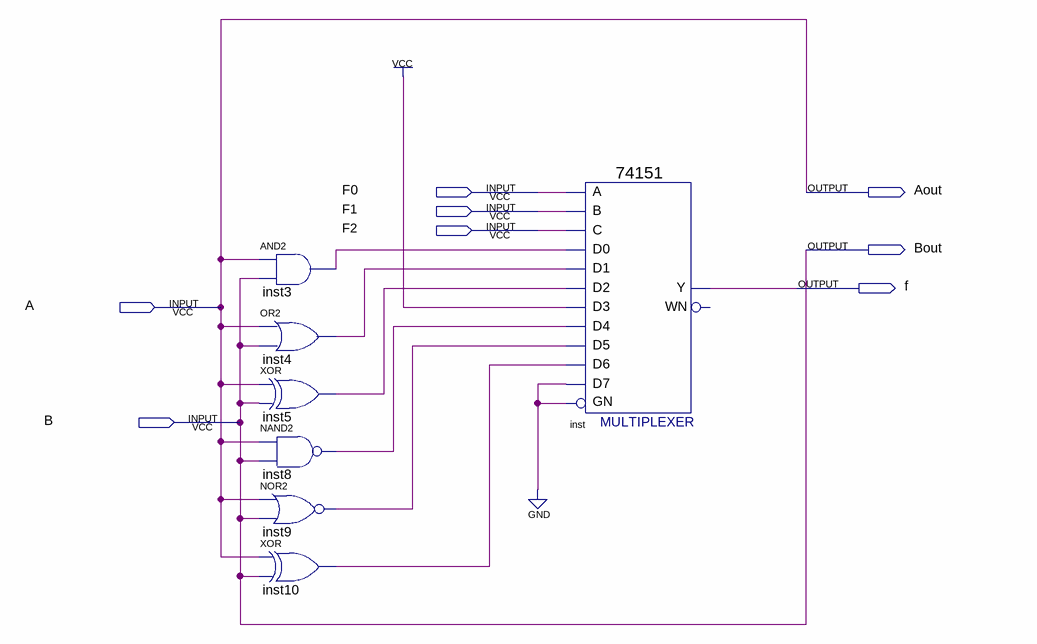
[diagram p0: schematic sheet]
// Quartus schematic Functionselect.bdf as structural Verilog: 7 symbols, 8 pins
module Functionselect (
  input  F0,
  input  F1,
  input  F2,
  input  A,
  input  B,
  output Aout,
  output Bout,
  output f
);

  wire inst3_out, inst4_out, inst5_out, inst8_out, inst9_out, inst10_out;

  and inst3 (inst3_out, A, B);
  or inst4 (inst4_out, A, B);
  xor inst5 (inst5_out, A, B);
  nand inst8 (inst8_out, A, B);
  nor inst9 (inst9_out, A, B);
  xor inst10 (inst10_out, A, B);
  \74151  inst (
    .GN(1'b0), .C(F2), .B(F1), .A(F0), .D5(inst9_out), .D0(inst3_out), .D1(inst4_out), .D4(inst8_out),
    .D3(1'b1), .D2(inst5_out), .D6(inst10_out), .D7(1'b0), .Y(f));  // open: WN

  assign Aout = A;
  assign Bout = B;
endmodule
